# Altium schematic sheet CodecA.SchDoc
size A4; SheetNumber: 10; SheetTotal: 14
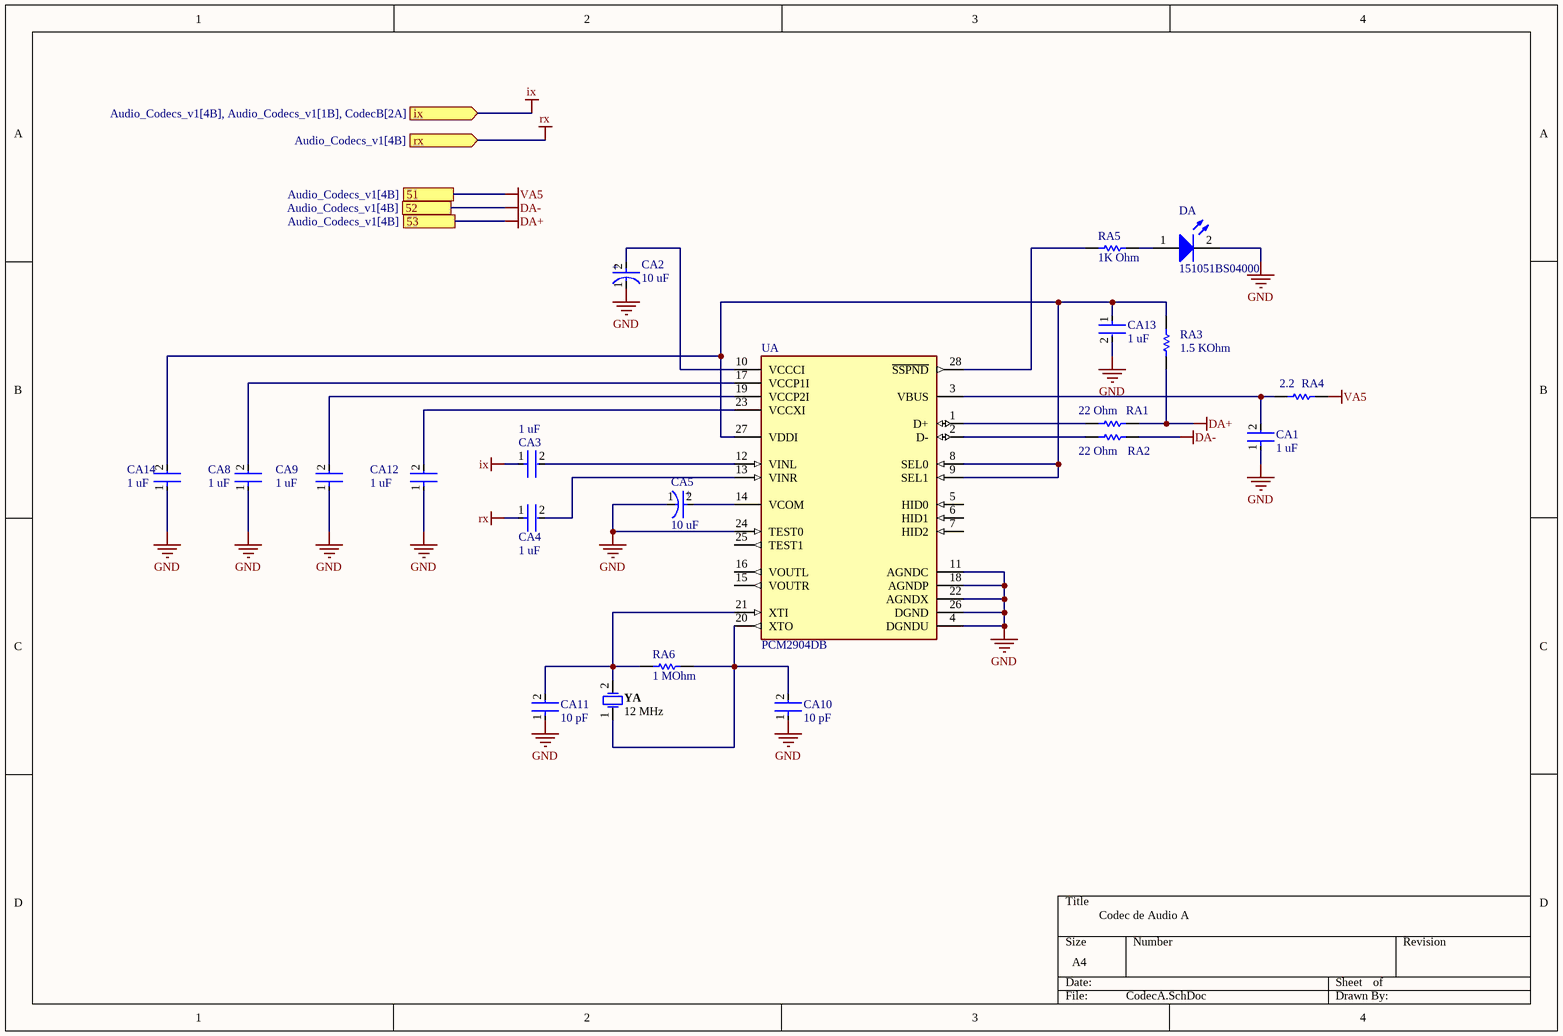
[diagram p0: CodecA.SchDoc]

## Parts
CA1  1 uF  [FP-CC0805-0_85-MFG]
CA2  10 uF  [FP-RAD-TH-D_6_3_0_5-L_7_1-MFG]
CA3  1 uF  [FP-CC0805-0_85-MFG]
CA4  1 uF  [FP-CC0805-0_85-MFG]
CA5  10 uF  [FP-RAD-TH-D_6_3_0_5-L_7_1-MFG]
CA8  1 uF  [FP-CC0805-0_85-MFG]
CA9  1 uF  [FP-CC0805-0_85-MFG]
CA10  10 pF  [FP-CC0805-0_85-MFG]
CA11  10 pF  [FP-CC0805-0_85-MFG]
CA12  1 uF  [FP-CC0805-0_85-MFG]
CA13  1 uF  [FP-CC0805-0_85-MFG]
CA14  1 uF  [FP-CC0805-0_85-MFG]
DA  151051BS04000  [WL-TMRC_D5.9H8.7]
RA1  22 Ohm  [RESC2013X60X40ML20T25]
RA2  22 Ohm  [RESC2013X60X40ML20T25]
RA3  1.5 KOhm  [RESC2013X60X40ML20T25]
RA4  2.2  [RESC2013X60X40ML20T25]
RA5  1K Ohm  [RESC2013X60X40ML20T25]
RA6  1 MOhm  [RESC2013X60X40ML20T25]
UA  PCM2904DB  [FP-DB0028A-IPC_A]
YA  12 MHz  [FOX-FOXSLF160-20]

## Ports
51 (see Audio_Codecs_v1[4B]), 52 (see Audio_Codecs_v1[4B]), 53 (see Audio_Codecs_v1[4B]), ix (in, see Audio_Codecs_v1[4B], Audio_Codecs_v1[1B], CodecB[2A]), rx (in, see Audio_Codecs_v1[4B])

## Nets
DA+: RA1.1 RA3.2 ; port 53
DA-: RA2.2 ; port 52
GND: CA1.1 CA2.1(C) CA5.1(C) CA8.1 CA9.1 CA10.1 CA11.1 CA12.1 CA13.2 CA14.1 DA.2(K) UA.4(DGNDU) UA.11(AGNDC) UA.18(AGNDP) UA.22(AGNDX) UA.24(TEST0) UA.26(DGND)
ix: CA3.1 ; port ix
rx: CA4.1 ; port rx
VA5: RA4.1 ; port 51
NetCA1_2: CA1.2 RA4.2 UA.3(VBUS)
NetCA2_2: CA2.2(A) UA.10(VCCCI)
NetCA3_2: CA3.2 UA.12(VINL)
NetCA4_2: CA4.2 UA.13(VINR)
NetCA5_2: CA5.2(A) UA.14(VCOM)
NetCA8_2: CA8.2 UA.17(VCCP1I)
NetCA9_2: CA9.2 UA.19(VCCP2I)
NetCA10_2: CA10.2 RA6.2 UA.20(XTO) YA.1
NetCA11_2: CA11.2 RA6.1 UA.21(XTI) YA.2
NetCA12_2: CA12.2 UA.23(VCCXI)
NetCA13_1: CA13.1 CA14.2 RA3.1 UA.8(SEL0) UA.9(SEL1) UA.27(VDDI)
NetDA_1: DA.1(A) RA5.1
NetRA1_2: RA1.2 UA.1(D+)
NetRA2_1: RA2.1 UA.2(D-)
NetRA5_2: RA5.2 UA.28(~{SSPND})

Not connected (* = marked no-connect by the designer): UA 5(HID0) 6(HID1) 7(HID2) 15(VOUTR) 16(VOUTL) 25(TEST1)

## Notes on the sheet
- Codec de Audio A
- (in symbol CMP-05427-001316-1) +

## Library data of the parts
CA1 CA3 CA4 CA8-CA14 = CMP-2100-03606-3: CAP CER 0.1UF 50V X7R 0805; Manufacturer Part Number: CC0805KRX7R9BB104; Manufacturer: Yageo; Tolerance: 0.1; Capacitance: 100 nF; Value: 100 nF; Device Class L1: Passive Components; ComponentLink2Description: Datasheet; Package: CC0805-0.85; Digikey Description: CAP CER 0.1UF 50V X7R 0805; Device Class L3: Ceramic Capacitors; Temperature: -30°C to +85°C; Temperature Characteristic: X7R; Voltage Rating: 50 V; Height: 0.95mm; RoHS: TRUE; Ipc Land Pattern Name: CAPC200125X85; Device Class L2: Capacitors; Category: Cap; Temperature Range Low: -30°C; Temperature Range High: +85°C; Material: Ceramic; Mouser Description: Multilayer Ceramic Capacitors MLCC - SMD/SMT 100nF 50V X7R 10%; Footprint Url: http://www.yageo.com/exep/pages/download/literatures/UPY-C_GEN_24.pdf; Automotive: No; Octopart: https://octopart.com/cc0805krx7r9bb104-yageo-192993; Lead Free: Yes; ComponentLink2URL: http://www.yageo.com/documents/recent/UPY-GPHC_Y5V_6.3V-to-50V_8.pdf
CA2 CA5 = CMP-05427-001316-1: Aluminum Electrolytic Capacitors (Radial Lead Type) 100uF ±20% 16V; Life (Hours): 1000Hour; Lead Diameter: 0.45mm; Polarity: Polar; Ripple Current: 91mA; Series: KA; Packaging: Tape and Reel; Voltage Rating: 16V; Voltage Rating (DC): 16V; Min Operating Temperature: -40°C; Lead Pitch: 2.5mm; Mount: Through Hole; Height - Seated (Max): 0.315inch; Package Quantity: 2000; Length: 7mm; Termination: Radial; Voltage: 16V; Diameter: 6.3mm; Height: 7mm; Radiation Hardening: No; RoHS Compliant: Yes; Tolerance: 20%; Capacitance: 100uF; Case/Package: Radial; Max Operating Temperature: 85°C
DA = CMP-1488-00009-2: NexarPartId: 29717812; Test Current: 20mA; Forward Voltage: 3.2V; Wavelength: 470nm; Lens Size: 5mm; Lens Style: Circular, Diffused, Round; Forward Current: 100mA; Peak Wavelength: 465nm; Viewing Angle: 40°; Luminous Intensity: 500mcd; Max Reverse Voltage (DC): 5V; Case/Package: Radial; Width: 5mm; Mount: Through Hole; Min Operating Temperature: -40°C; Length: 5mm; Height: 8.6mm; Max Operating Temperature: 85°C; Packaging: Bulk; Color: Blue; RoHS: Compliant; REACH SVHC: Unknown; Dominant Wavelength: 470nm
RA1-RA6 = CMP-2001-00580-1: Manufacturer: Panasonic; Part Number: ERA6AEB101V
UA = CMP-04873-000006-1: IC STEREO AUD CODEC W/USB 28SSOP; Max Supply Voltage: 5.25V; Number of Analog Outputs: 2; Operating Supply Voltage: 5V; Number of A/D Converters: 1; Min Supply Voltage: 3.25V; Resolution: 16b; Nominal Supply Current: 67mA; Number of Bits: 16; Sampling Rate: 48KS/s; Signal to Noise Ratio (SNR): 89dB; Interface: USB; Width: 5.3mm; Length: 10.2mm; Radiation Hardening: No; Weight: 0.010081oz; Height: 1.95mm; Mount: Surface Mount; Number of Analog Inputs: 2; RoHS Compliant: Yes; Lead Free: Lead Free; Number of DAC Channels: 2; Max Operating Temperature: 85°C; Number of Channels: 2; Number of Pins: 28; Packaging: Rail/Tube; Case/Package: SSOP; Number of ADC Channels: 2; Number of D/A Converters: 1; Min Operating Temperature: -25°C; Package Quantity: 47; Type: General Purpose
YA = CMP-1749-00003-1: Resistance Weld Thru-Hole Crystal, 16 MHz, -20 to 70 degC, 2-Pin THD, RoHS, Bulk; Voltage Rating: 250 V; Tolerance: 1%; Resistance: 221 kohm; Case\Package: Axial; Power Rating: 250 mW; RoHSCompliant: true; Package Quantity: 200; Packaging: Bulk; Min Operating Temperature: -55 degC; DatasheetVersion: Mar-15; ComponentLink1URL: http://www.foxonline.com/; Max Operating Temperature: 155 degC; PackageReference: FOXSLF160-20; Mount: Through Hole; PackageDescription: 2-Pin Through Hole Device, Body 11.35 x 4.65 mm; ComponentLink1Description: Manufacturer URL; ComponentLink2URL: http://www.foxonline.com/pdfs/hc49slf.pdf; ComponentLink2Description: Datasheet; Length: 0.248 inch